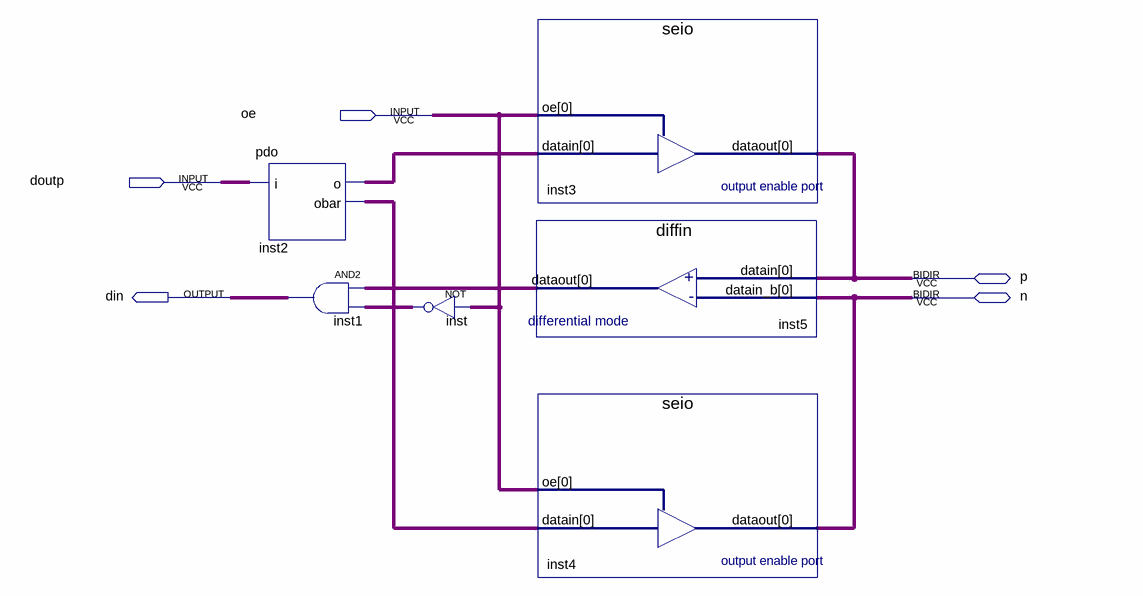
[diagram p0: schematic sheet]
// Quartus schematic buslvds.bdf as structural Verilog: 6 symbols, 5 pins
module buslvds (
  input  oe,
  input  doutp,
  inout  p,
  inout  n,
  output din
);

  wire inst2_o, inst2_obar, inst5_dataout, inst_out;

  pdo inst2 (.i(doutp), .o(inst2_o), .obar(inst2_obar));
  and inst1 (din, inst5_dataout, inst_out);
  not inst (inst_out, oe);
  seio inst3 (.datain(inst2_o), .oe(oe), .dataout(p));
  diffin inst5 (.datain(p), .datain_b(n), .dataout(inst5_dataout));
  seio inst4 (.datain(inst2_obar), .oe(oe), .dataout(n));
endmodule
